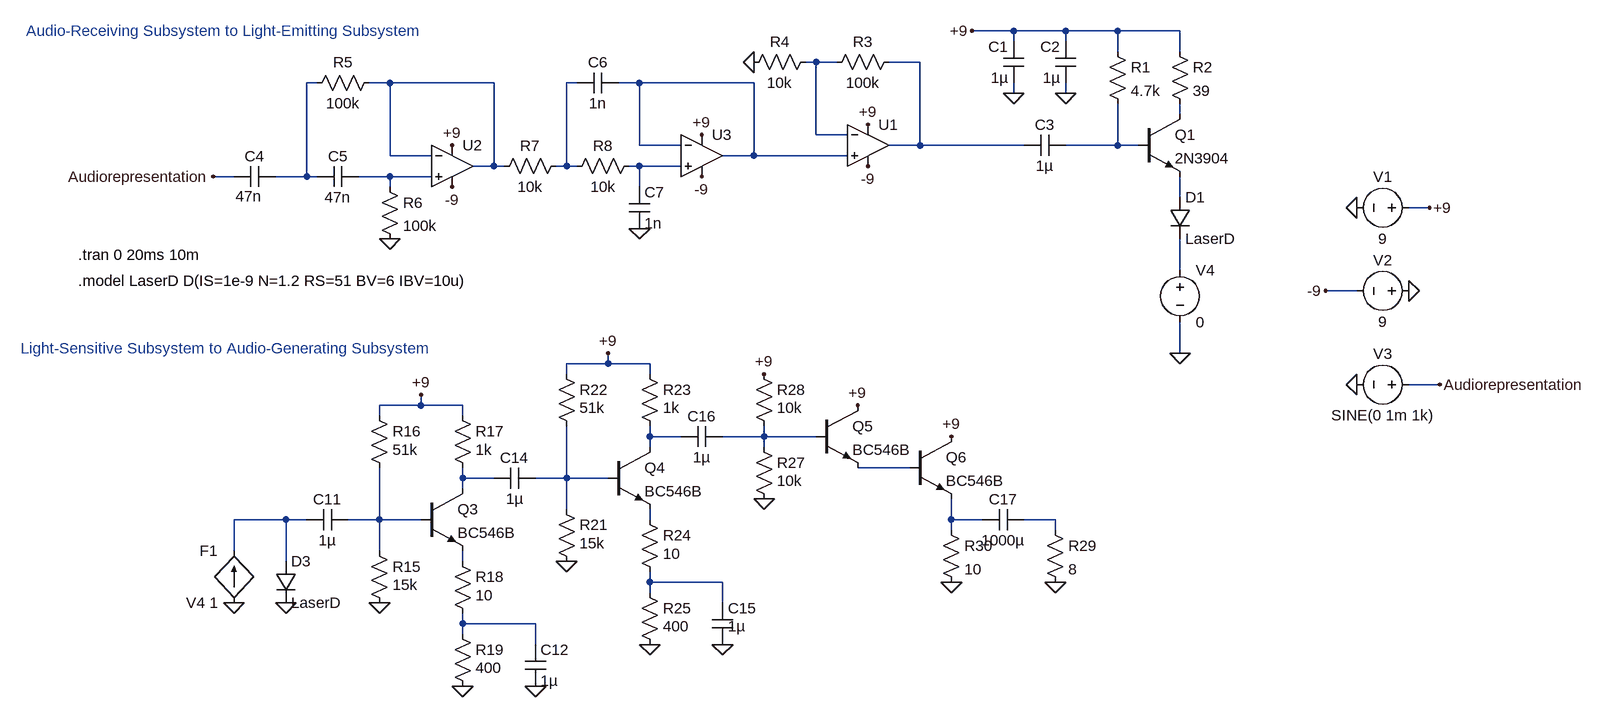
[diagram p0: schematic project_deneme_c2.asc]
project_deneme_c2.asc, the LTspice schematic file:
Version 4
SHEET 1 2692 1444
WIRE 256 192 192 192
WIRE 336 192 256 192
WIRE 416 192 336 192
WIRE 512 192 416 192
WIRE 256 208 256 192
WIRE 336 208 336 192
WIRE 416 224 416 192
WIRE 512 224 512 192
WIRE -48 240 -64 240
WIRE -16 240 -48 240
WIRE 112 240 64 240
WIRE -816 272 -832 272
WIRE -704 272 -736 272
WIRE -544 272 -704 272
WIRE -416 272 -432 272
WIRE -320 272 -352 272
WIRE -144 272 -320 272
WIRE 256 288 256 272
WIRE 336 288 336 272
WIRE 512 320 512 304
WIRE -48 352 -48 240
WIRE 0 352 -48 352
WIRE -320 368 -320 272
WIRE -256 368 -320 368
WIRE 112 368 112 240
WIRE 112 368 64 368
WIRE 272 368 112 368
WIRE 416 368 416 304
WIRE 416 368 336 368
WIRE 448 368 416 368
WIRE -704 384 -704 272
WIRE -640 384 -704 384
WIRE -144 384 -144 272
WIRE -144 384 -192 384
WIRE 0 384 -144 384
WIRE -544 400 -544 272
WIRE -544 400 -576 400
WIRE -528 400 -544 400
WIRE -432 400 -432 272
WIRE -432 400 -448 400
WIRE -416 400 -432 400
WIRE -320 400 -336 400
WIRE -256 400 -320 400
WIRE -944 416 -976 416
WIRE -832 416 -832 272
WIRE -832 416 -880 416
WIRE -816 416 -832 416
WIRE -704 416 -752 416
WIRE -640 416 -704 416
WIRE -704 432 -704 416
WIRE -320 432 -320 400
WIRE 512 448 512 416
WIRE 896 464 864 464
WIRE 512 560 512 512
WIRE 784 592 736 592
WIRE 512 688 512 640
WIRE -368 704 -368 688
WIRE -368 704 -432 704
WIRE -304 704 -368 704
WIRE -432 720 -432 704
WIRE -304 720 -304 704
WIRE 912 736 864 736
WIRE -656 768 -656 752
WIRE -656 768 -720 768
WIRE -592 768 -656 768
WIRE -720 784 -720 768
WIRE -592 784 -592 768
WIRE -304 816 -304 800
WIRE -256 816 -304 816
WIRE -128 816 -128 800
WIRE -128 816 -192 816
WIRE -48 816 -128 816
WIRE -304 832 -304 816
WIRE -128 832 -128 816
WIRE 96 864 16 864
WIRE -592 880 -592 864
WIRE -544 880 -592 880
WIRE -432 880 -432 800
WIRE -432 880 -480 880
WIRE -368 880 -432 880
WIRE -592 896 -592 880
WIRE -432 928 -432 880
WIRE -864 944 -944 944
WIRE -832 944 -864 944
WIRE -720 944 -720 864
WIRE -720 944 -768 944
WIRE -656 944 -720 944
WIRE -304 944 -304 928
WIRE 160 944 160 912
WIRE 208 944 160 944
WIRE 320 944 272 944
WIRE 160 960 160 944
WIRE 320 960 320 944
WIRE -944 992 -944 944
WIRE -720 992 -720 944
WIRE -864 1008 -864 944
WIRE -592 1008 -592 992
WIRE -304 1040 -304 1024
WIRE -192 1040 -304 1040
WIRE -304 1056 -304 1040
WIRE -192 1072 -192 1040
WIRE -592 1104 -592 1088
WIRE -480 1104 -592 1104
WIRE -592 1120 -592 1104
WIRE -480 1136 -480 1104
FLAG 336 288 0
FLAG 256 288 0
FLAG 32 336 +9
FLAG 32 400 -9
FLAG -144 240 0
FLAG -704 512 0
FLAG -608 368 +9
FLAG -224 352 +9
FLAG -224 416 -9
FLAG -608 432 -9
FLAG -320 496 0
FLAG 192 192 +9
FLAG -720 1072 0
FLAG -656 752 +9
FLAG -432 1008 0
FLAG -368 688 +9
FLAG -304 1136 0
FLAG -192 1136 0
FLAG -128 912 0
FLAG -128 720 +9
FLAG 16 768 +9
FLAG 160 816 +9
FLAG 160 1040 0
FLAG 320 1040 0
FLAG -592 1200 0
FLAG -480 1200 0
FLAG -944 1072 0
FLAG -864 1072 0
FLAG -976 416 Audiorepresentation
FLAG 512 688 0
FLAG 784 464 0
FLAG 864 592 0
FLAG 784 736 0
FLAG 896 464 +9
FLAG 736 592 -9
FLAG 912 736 Audiorepresentation
SYMBOL cap 272 272 R180
WINDOW 0 24 56 Left 2
WINDOW 3 24 8 Left 2
SYMATTR InstName C1
SYMATTR Value 1µ
SYMBOL cap 352 272 R180
WINDOW 0 24 56 Left 2
WINDOW 3 24 8 Left 2
SYMATTR InstName C2
SYMATTR Value 1µ
SYMBOL cap 336 352 R90
WINDOW 0 0 32 VBottom 2
WINDOW 3 32 32 VTop 2
SYMATTR InstName C3
SYMATTR Value 1µ
SYMBOL res 400 208 R0
SYMATTR InstName R1
SYMATTR Value 4.7k
SYMBOL res 496 208 R0
SYMATTR InstName R2
SYMATTR Value 39
SYMBOL npn 448 320 R0
SYMATTR InstName Q1
SYMATTR Value 2N3904
SYMBOL diode 496 448 R0
SYMATTR InstName D1
SYMATTR Value LaserD
SYMBOL OpAmps\\UniversalOpAmp2 32 368 R0
SYMATTR InstName U1
SYMBOL res 80 224 R90
WINDOW 0 0 56 VBottom 2
WINDOW 3 32 56 VTop 2
SYMATTR InstName R3
SYMATTR Value 100k
SYMBOL res -160 256 R270
WINDOW 0 32 56 VTop 2
WINDOW 3 0 56 VBottom 2
SYMATTR InstName R4
SYMATTR Value 10k
SYMBOL cap -880 432 M270
WINDOW 0 32 32 VTop 2
WINDOW 3 -14 61 VLeft 2
SYMATTR InstName C4
SYMATTR Value 47n
SYMBOL cap -752 400 R90
WINDOW 0 0 32 VBottom 2
WINDOW 3 32 32 VTop 2
SYMATTR InstName C5
SYMATTR Value 47n
SYMBOL res -720 256 R90
WINDOW 0 0 56 VBottom 2
WINDOW 3 32 56 VTop 2
SYMATTR InstName R5
SYMATTR Value 100k
SYMBOL res -720 416 R0
SYMATTR InstName R6
SYMATTR Value 100k
SYMBOL OpAmps\\UniversalOpAmp2 -608 400 R0
SYMATTR InstName U2
SYMBOL OpAmps\\UniversalOpAmp2 -224 384 R0
SYMATTR InstName U3
SYMBOL res -432 384 R90
WINDOW 0 0 56 VBottom 2
WINDOW 3 32 56 VTop 2
SYMATTR InstName R7
SYMATTR Value 10k
SYMBOL cap -352 256 R90
WINDOW 0 0 32 VBottom 2
WINDOW 3 32 32 VTop 2
SYMATTR InstName C6
SYMATTR Value 1n
SYMBOL cap -336 432 R0
SYMATTR InstName C7
SYMATTR Value 1n
SYMBOL res -320 384 R90
WINDOW 0 0 56 VBottom 2
WINDOW 3 32 56 VTop 2
SYMATTR InstName R8
SYMATTR Value 10k
SYMBOL cap -768 928 R90
WINDOW 0 0 32 VBottom 2
WINDOW 3 32 32 VTop 2
SYMATTR InstName C11
SYMATTR Value 1µ
SYMBOL res -736 976 R0
WINDOW 3 36 68 Left 2
SYMATTR Value 15k
SYMATTR InstName R15
SYMBOL res -736 768 R0
WINDOW 3 36 68 Left 2
SYMATTR Value 51k
SYMATTR InstName R16
SYMBOL res -608 768 R0
WINDOW 3 36 68 Left 2
SYMATTR Value 1k
SYMATTR InstName R17
SYMBOL npn -656 896 R0
SYMATTR InstName Q3
SYMATTR Value BC546B
SYMBOL cap -480 864 R90
WINDOW 0 0 32 VBottom 2
WINDOW 3 32 32 VTop 2
SYMATTR InstName C14
SYMATTR Value 1µ
SYMBOL res -448 912 R0
WINDOW 3 36 68 Left 2
SYMATTR Value 15k
SYMATTR InstName R21
SYMBOL res -448 704 R0
WINDOW 3 36 68 Left 2
SYMATTR Value 51k
SYMATTR InstName R22
SYMBOL res -320 704 R0
WINDOW 3 36 68 Left 2
SYMATTR Value 1k
SYMATTR InstName R23
SYMBOL npn -368 832 R0
SYMATTR InstName Q4
SYMATTR Value BC546B
SYMBOL res -320 928 R0
WINDOW 3 36 68 Left 2
SYMATTR Value 10
SYMATTR InstName R24
SYMBOL res -320 1040 R0
WINDOW 3 36 68 Left 2
SYMATTR Value 400
SYMATTR InstName R25
SYMBOL cap -208 1072 R0
WINDOW 3 24 36 Left 2
SYMATTR Value 1µ
SYMATTR InstName C15
SYMBOL cap -192 800 R90
WINDOW 0 0 32 VBottom 2
WINDOW 3 32 32 VTop 2
SYMATTR InstName C16
SYMATTR Value 1µ
SYMBOL res -144 816 R0
WINDOW 3 36 68 Left 2
SYMATTR Value 10k
SYMATTR InstName R27
SYMBOL res -144 704 R0
WINDOW 3 36 68 Left 2
SYMATTR Value 10k
SYMATTR InstName R28
SYMBOL npn -48 768 R0
SYMATTR InstName Q5
SYMATTR Value BC546B
SYMBOL npn 96 816 R0
SYMATTR InstName Q6
SYMATTR Value BC546B
SYMBOL cap 272 928 R90
WINDOW 0 0 32 VBottom 2
WINDOW 3 32 32 VTop 2
SYMATTR InstName C17
SYMATTR Value 1000µ
SYMBOL res 304 944 R0
SYMATTR InstName R29
SYMATTR Value 8
SYMBOL res 144 944 R0
SYMATTR InstName R30
SYMATTR Value 10
SYMBOL res -608 992 R0
WINDOW 3 36 68 Left 2
SYMATTR Value 10
SYMATTR InstName R18
SYMBOL res -608 1104 R0
WINDOW 3 36 68 Left 2
SYMATTR Value 400
SYMATTR InstName R19
SYMBOL cap -496 1136 R0
SYMATTR InstName C12
SYMATTR Value 1µ
SYMBOL diode -880 1008 R0
SYMATTR InstName D3
SYMATTR Value LaserD
SYMBOL voltage 880 464 R90
WINDOW 0 -32 56 VBottom 2
WINDOW 3 32 56 VTop 2
WINDOW 123 0 0 Left 0
WINDOW 39 0 0 Left 0
SYMATTR InstName V1
SYMATTR Value 9
SYMBOL voltage 880 592 R90
WINDOW 0 -32 56 VBottom 2
WINDOW 3 32 56 VTop 2
WINDOW 123 0 0 Left 0
WINDOW 39 0 0 Left 0
SYMATTR InstName V2
SYMATTR Value 9
SYMBOL voltage 880 736 R90
WINDOW 0 -32 56 VBottom 2
WINDOW 3 32 56 VTop 2
WINDOW 123 0 0 Left 0
WINDOW 39 0 0 Left 0
SYMATTR InstName V3
SYMATTR Value SINE(0 1m 1k)
SYMBOL voltage 512 544 R0
WINDOW 123 0 0 Left 0
WINDOW 39 0 0 Left 0
SYMATTR InstName V4
SYMATTR Value 0
SYMBOL f -944 1072 R180
WINDOW 0 24 80 Left 2
WINDOW 3 24 0 Left 2
SYMATTR InstName F1
SYMATTR Value V4 1
TEXT -1184 536 Left 2 !.tran 0 20ms 10m
TEXT -1184 576 Left 2 !.model LaserD D(IS=1e-9 N=1.2 RS=51 BV=6 IBV=10u)
TEXT -1264 192 Left 2 ;Audio-Receiving Subsystem to Light-Emitting Subsystem
TEXT -1272 680 Left 2 ;Light-Sensitive Subsystem to Audio-Generating Subsystem

The netlist it stands for:
* project_deneme_c2.asc
C1 0 +9 1µ
C2 0 +9 1µ
C3 N008 N002 1µ
R1 +9 N008 4.7k
R2 +9 N007 39
Q1 N007 N008 N011 0 2N3904
D1 N011 N012 LaserD
XU1 N006 N001 +9 -9 N002 level2 Avol=1Meg GBW=10Meg Slew=10Meg Ilimit=25m Rail=0 Vos=0 En=0 Enk=0 In=0 Ink=0 Rin=500Meg  ; pins In+ In- V+ V- OUT
R3 N002 N001 100k
R4 0 N001 10k
C4 N003 Audiorepresentation 47n
C5 N010 N003 47n
R5 N004 N003 100k
R6 N010 0 100k
XU2 N010 N004 +9 -9 N004 level2 Avol=1Meg GBW=10Meg Slew=10Meg Ilimit=25m Rail=0 Vos=0 En=0 Enk=0 In=0 Ink=0 Rin=500Meg  ; pins In+ In- V+ V- OUT
XU3 N009 N006 +9 -9 N006 level2 Avol=1Meg GBW=10Meg Slew=10Meg Ilimit=25m Rail=0 Vos=0 En=0 Enk=0 In=0 Ink=0 Rin=500Meg  ; pins In+ In- V+ V- OUT
R7 N005 N004 10k
C6 N006 N005 1n
C7 N009 0 1n
R8 N009 N005 10k
C11 N019 N018 1µ
R15 N019 0 15k
R16 +9 N019 51k
R17 +9 N016 1k
Q3 N016 N019 N023 0 BC546B
C14 N017 N016 1µ
R21 N017 0 15k
R22 +9 N017 51k
R23 +9 N013 1k
Q4 N013 N017 N020 0 BC546B
R24 N020 N024 10
R25 N024 0 400
C15 N024 0 1µ
C16 N014 N013 1µ
R27 N014 0 10k
R28 +9 N014 10k
Q5 +9 N014 N015 0 BC546B
Q6 +9 N015 N021 0 BC546B
C17 N022 N021 1000µ
R29 N022 0 8
R30 N021 0 10
R18 N023 N025 10
R19 N025 0 400
C12 N025 0 1µ
D3 N018 0 LaserD
V1 +9 0 9
V2 0 -9 9
V3 Audiorepresentation 0 SINE(0 1m 1k)
V4 N012 0 0
F1 0 N018 V4 1
.model D D
.lib standard.dio
.model NPN NPN
.model PNP PNP
.lib standard.bjt
.tran 0 20ms 10m
.model LaserD D(IS=1e-9 N=1.2 RS=51 BV=6 IBV=10u)
* Audio-Receiving Subsystem to Light-Emitting Subsystem
* Light-Sensitive Subsystem to Audio-Generating Subsystem
.lib UniversalOpAmp2.lib
.backanno
.end